# Altium schematic sheet FPGA_SPI.SchDoc: FIT_PM12 board
size 420 x 297 mm; CheckedBy: G.Kasprowicz; Author: INR Moscow; CompanyName: WUT ISE; DrawnBy: M.Podgórski; Organization: WUT ISE; Address1: PW ISE; Address2: Nowowiejska 15/19 00-665 Warsaw; Address3: gkasprow@gmail.com; Revision: 2; SheetNumber: -; SheetTotal: -; ModifiedBy: -; CheckedDate: -; Title2: Title 2; DivGrp: WUT ISE; Designer: INR RAS; ModifiedDate: -; ProjectName: Sensor Box
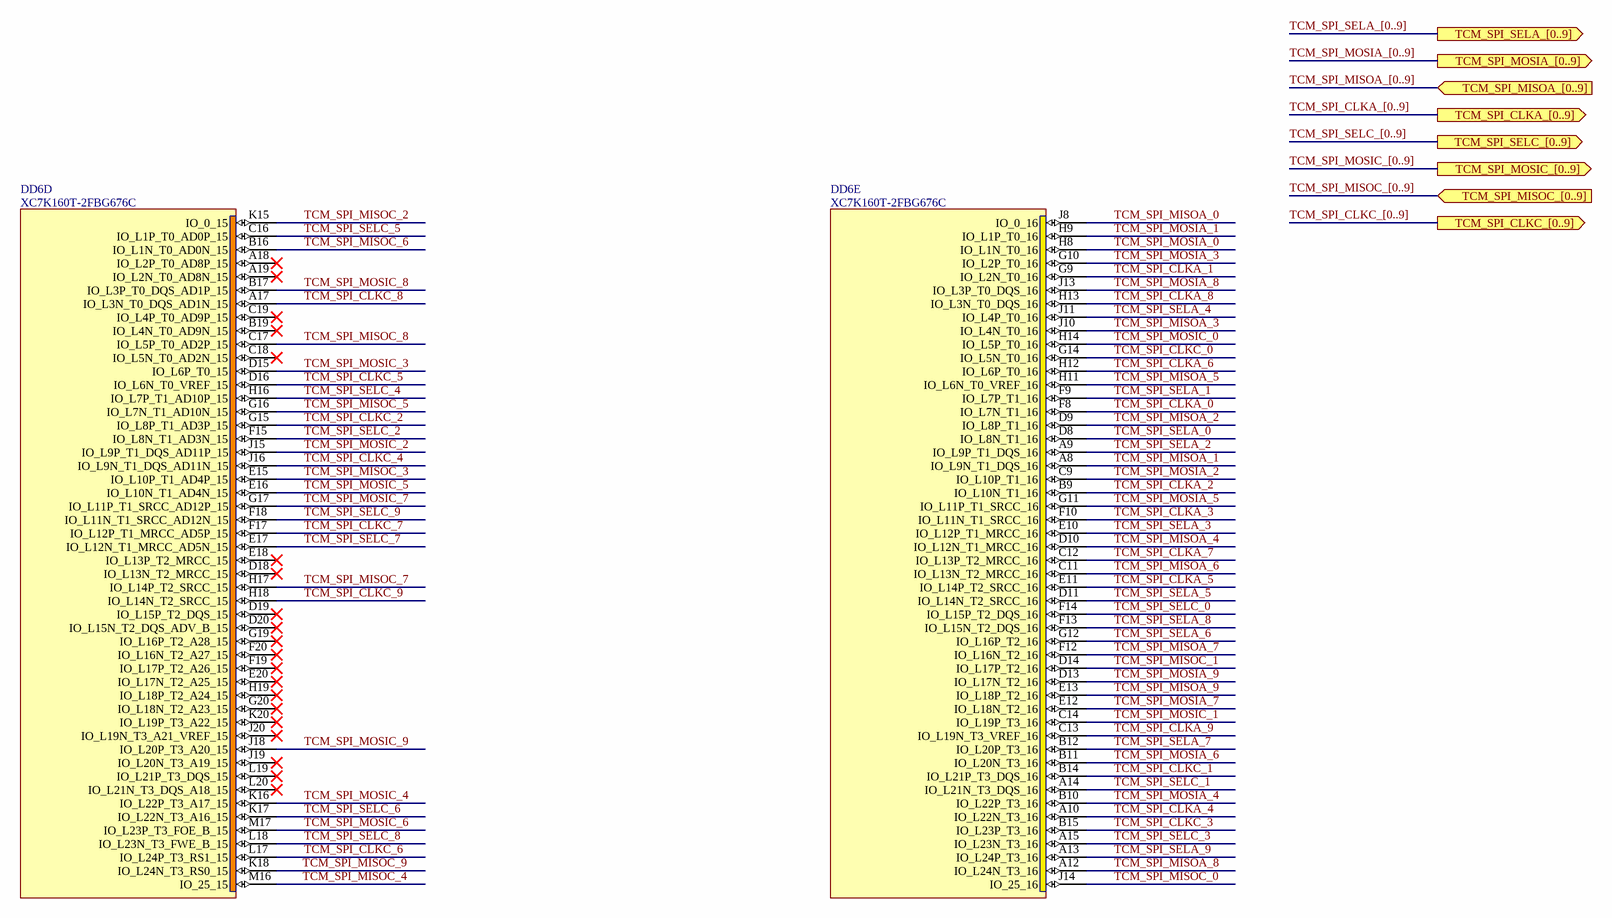
[diagram p0: FPGA_SPI.SchDoc]

## Parts
DD6  XC7K160T-2FBG676C  [BGA676C100P26X26_2700X2700X254]  (parts D,E of 15)

## Ports
TCM_SPI_CLKA_[0..9] (out), TCM_SPI_CLKC_[0..9] (out), TCM_SPI_MISOA_[0..9] (in), TCM_SPI_MISOC_[0..9] (in), TCM_SPI_MOSIA_[0..9] (out), TCM_SPI_MOSIC_[0..9] (out), TCM_SPI_SELA_[0..9] (out), TCM_SPI_SELC_[0..9] (out)

## Nets
TCM_SPI_CLKA_0: DD6.F8(IO_L7N_T1_16)
TCM_SPI_CLKA_1: DD6.G9(IO_L2N_T0_16)
TCM_SPI_CLKA_2: DD6.B9(IO_L10N_T1_16)
TCM_SPI_CLKA_3: DD6.F10(IO_L11N_T1_SRCC_16)
TCM_SPI_CLKA_4: DD6.A10(IO_L22N_T3_16)
TCM_SPI_CLKA_5: DD6.E11(IO_L14P_T2_SRCC_16)
TCM_SPI_CLKA_6: DD6.H12(IO_L6P_T0_16)
TCM_SPI_CLKA_7: DD6.C12(IO_L13P_T2_MRCC_16)
TCM_SPI_CLKA_8: DD6.H13(IO_L3N_T0_DQS_16)
TCM_SPI_CLKA_9: DD6.C13(IO_L19N_T3_VREF_16)
TCM_SPI_CLKC_0: DD6.G14(IO_L5N_T0_16)
TCM_SPI_CLKC_1: DD6.B14(IO_L21P_T3_DQS_16)
TCM_SPI_CLKC_2: DD6.G15(IO_L8P_T1_AD3P_15)
TCM_SPI_CLKC_3: DD6.B15(IO_L23P_T3_16)
TCM_SPI_CLKC_4: DD6.J16(IO_L9N_T1_DQS_AD11N_15)
TCM_SPI_CLKC_5: DD6.D16(IO_L6N_T0_VREF_15)
TCM_SPI_CLKC_6: DD6.L17(IO_L24P_T3_RS1_15)
TCM_SPI_CLKC_7: DD6.F17(IO_L12P_T1_MRCC_AD5P_15)
TCM_SPI_CLKC_8: DD6.A17(IO_L3N_T0_DQS_AD1N_15)
TCM_SPI_CLKC_9: DD6.H18(IO_L14N_T2_SRCC_15)
TCM_SPI_MISOA_0: DD6.J8(IO_0_16)
TCM_SPI_MISOA_1: DD6.A8(IO_L9N_T1_DQS_16)
TCM_SPI_MISOA_2: DD6.D9(IO_L8P_T1_16)
TCM_SPI_MISOA_3: DD6.J10(IO_L4N_T0_16)
TCM_SPI_MISOA_4: DD6.D10(IO_L12N_T1_MRCC_16)
TCM_SPI_MISOA_5: DD6.H11(IO_L6N_T0_VREF_16)
TCM_SPI_MISOA_6: DD6.C11(IO_L13N_T2_MRCC_16)
TCM_SPI_MISOA_7: DD6.F12(IO_L16N_T2_16)
TCM_SPI_MISOA_8: DD6.A12(IO_L24N_T3_16)
TCM_SPI_MISOA_9: DD6.E13(IO_L18P_T2_16)
TCM_SPI_MISOC_0: DD6.J14(IO_25_16)
TCM_SPI_MISOC_1: DD6.D14(IO_L17P_T2_16)
TCM_SPI_MISOC_2: DD6.K15(IO_0_15)
TCM_SPI_MISOC_3: DD6.E15(IO_L10P_T1_AD4P_15)
TCM_SPI_MISOC_4: DD6.M16(IO_25_15)
TCM_SPI_MISOC_5: DD6.G16(IO_L7N_T1_AD10N_15)
TCM_SPI_MISOC_6: DD6.B16(IO_L1N_T0_AD0N_15)
TCM_SPI_MISOC_7: DD6.H17(IO_L14P_T2_SRCC_15)
TCM_SPI_MISOC_8: DD6.C17(IO_L5P_T0_AD2P_15)
TCM_SPI_MISOC_9: DD6.K18(IO_L24N_T3_RS0_15)
TCM_SPI_MOSIA_0: DD6.H8(IO_L1N_T0_16)
TCM_SPI_MOSIA_1: DD6.H9(IO_L1P_T0_16)
TCM_SPI_MOSIA_2: DD6.C9(IO_L10P_T1_16)
TCM_SPI_MOSIA_3: DD6.G10(IO_L2P_T0_16)
TCM_SPI_MOSIA_4: DD6.B10(IO_L22P_T3_16)
TCM_SPI_MOSIA_5: DD6.G11(IO_L11P_T1_SRCC_16)
TCM_SPI_MOSIA_6: DD6.B11(IO_L20N_T3_16)
TCM_SPI_MOSIA_7: DD6.E12(IO_L18N_T2_16)
TCM_SPI_MOSIA_8: DD6.J13(IO_L3P_T0_DQS_16)
TCM_SPI_MOSIA_9: DD6.D13(IO_L17N_T2_16)
TCM_SPI_MOSIC_0: DD6.H14(IO_L5P_T0_16)
TCM_SPI_MOSIC_1: DD6.C14(IO_L19P_T3_16)
TCM_SPI_MOSIC_2: DD6.J15(IO_L9P_T1_DQS_AD11P_15)
TCM_SPI_MOSIC_3: DD6.D15(IO_L6P_T0_15)
TCM_SPI_MOSIC_4: DD6.K16(IO_L22P_T3_A17_15)
TCM_SPI_MOSIC_5: DD6.E16(IO_L10N_T1_AD4N_15)
TCM_SPI_MOSIC_6: DD6.M17(IO_L23P_T3_FOE_B_15)
TCM_SPI_MOSIC_7: DD6.G17(IO_L11P_T1_SRCC_AD12P_15)
TCM_SPI_MOSIC_8: DD6.B17(IO_L3P_T0_DQS_AD1P_15)
TCM_SPI_MOSIC_9: DD6.J18(IO_L20P_T3_A20_15)
TCM_SPI_SELA_0: DD6.D8(IO_L8N_T1_16)
TCM_SPI_SELA_1: DD6.F9(IO_L7P_T1_16)
TCM_SPI_SELA_2: DD6.A9(IO_L9P_T1_DQS_16)
TCM_SPI_SELA_3: DD6.E10(IO_L12P_T1_MRCC_16)
TCM_SPI_SELA_4: DD6.J11(IO_L4P_T0_16)
TCM_SPI_SELA_5: DD6.D11(IO_L14N_T2_SRCC_16)
TCM_SPI_SELA_6: DD6.G12(IO_L16P_T2_16)
TCM_SPI_SELA_7: DD6.B12(IO_L20P_T3_16)
TCM_SPI_SELA_8: DD6.F13(IO_L15N_T2_DQS_16)
TCM_SPI_SELA_9: DD6.A13(IO_L24P_T3_16)
TCM_SPI_SELC_0: DD6.F14(IO_L15P_T2_DQS_16)
TCM_SPI_SELC_1: DD6.A14(IO_L21N_T3_DQS_16)
TCM_SPI_SELC_2: DD6.F15(IO_L8N_T1_AD3N_15)
TCM_SPI_SELC_3: DD6.A15(IO_L23N_T3_16)
TCM_SPI_SELC_4: DD6.H16(IO_L7P_T1_AD10P_15)
TCM_SPI_SELC_5: DD6.C16(IO_L1P_T0_AD0P_15)
TCM_SPI_SELC_6: DD6.K17(IO_L22N_T3_A16_15)
TCM_SPI_SELC_7: DD6.E17(IO_L12N_T1_MRCC_AD5N_15)
TCM_SPI_SELC_8: DD6.L18(IO_L23N_T3_FWE_B_15)
TCM_SPI_SELC_9: DD6.F18(IO_L11N_T1_SRCC_AD12N_15)

Not connected (* = marked no-connect by the designer): DD6 A18(IO_L2P_T0_AD8P_15)* A19(IO_L2N_T0_AD8N_15)* B19(IO_L4N_T0_AD9N_15)* C18(IO_L5N_T0_AD2N_15)* C19(IO_L4P_T0_AD9P_15)* D18(IO_L13N_T2_MRCC_15)* D19(IO_L15P_T2_DQS_15)* D20(IO_L15N_T2_DQS_ADV_B_15)* E18(IO_L13P_T2_MRCC_15)* E20(IO_L17N_T2_A25_15)* F19(IO_L17P_T2_A26_15)* F20(IO_L16N_T2_A27_15)* G19(IO_L16P_T2_A28_15)* G20(IO_L18N_T2_A23_15)* H19(IO_L18P_T2_A24_15)* J19(IO_L20N_T3_A19_15)* J20(IO_L19N_T3_A21_VREF_15)* K20(IO_L19P_T3_A22_15)* L19(IO_L21P_T3_DQS_15)* L20(IO_L21N_T3_DQS_A18_15)*

## Buses and harness runs
bus TCM_SPI_CLKA_[0..9] = port TCM_SPI_CLKA_[0..9]
bus TCM_SPI_CLKC_[0..9] = port TCM_SPI_CLKC_[0..9]
bus TCM_SPI_MISOA_[0..9] = port TCM_SPI_MISOA_[0..9]
bus TCM_SPI_MISOC_[0..9] = port TCM_SPI_MISOC_[0..9]
bus TCM_SPI_MOSIA_[0..9] = port TCM_SPI_MOSIA_[0..9]
bus TCM_SPI_MOSIC_[0..9] = port TCM_SPI_MOSIC_[0..9]
bus TCM_SPI_SELA_[0..9] = port TCM_SPI_SELA_[0..9]
bus TCM_SPI_SELC_[0..9] = port TCM_SPI_SELC_[0..9]

## Notes on the sheet
- Project/Equipment
- Document
- Designer
- Drawn by
- Check.by
- Copyright WUT ISE 2024.
  This documentation describes Open Hardware and is licensed under the CERN OHL v.2. You may redistribute and modify this documentation under the terms of the CERN OHL v.2. (http://ohwr.org/CERNOHL). This documentation is distributed WITHOUT ANY EXPRESS OR IMPLIED WARRANTY, INCLUDING OF MERCHANTABILITY, SATISFACTORY QUALITY AND FITNESS FOR A PARTICULAR PURPOSE. Please see the CERN OHL v.2 for applicable conditions.
- Contact
- File
- Last Mod.
- Print Date
- Sheet
- Size
- A3
- of
- Rev

## Library data of the parts
DD6 = XC7K160T-2FBG676C: KINTEX-7, FPGA, 676-Ball BGA, Pb-Free; Part Description: KINTEX-7 FPGA, 162240 Logic Cells, 400 User I/O, 8 GTXs, 676-Ball BGA, Speed Grade 2, Commercial Grade, Pb-Free; Manufacturer: XILINX; PressFit: No; Bonding: No; Part Number: XC7K160T-2FBG676C; Component Kind: Standard; Component Type: Standard; Device: XC7K160T-2FBG676C; PackageDescription: BGA, 1.00mm Pitch, Square; 676 Pin, 26 Columns X 26 Rows, Body 27.0mm X 27.0mm X 2.54mm H, IPC Medium Density; Manufacturer Part Number: XC7K160T-2FBG676C; Pin Count: 676; Case: BGA676; Mounted: Yes; Socket: No; SMD: Yes; Sense: No; ComponentHeight: 2.54mm; HelpURL: \\cern.ch\dfs\Applications\Altium\Datasheets\XC7K160T-xFBG676C.pdf; ComponentLink1URL: \\cern.ch\dfs\Applications\Altium\Datasheets\XC7K160T-xFBG676C_Package-Pinout.pdf; ComponentLink1Description: Package/Pinout; Author: CERN DEM BC; CreateDate: 06.02.2020; LatestRevisionDate: 06.02.2020